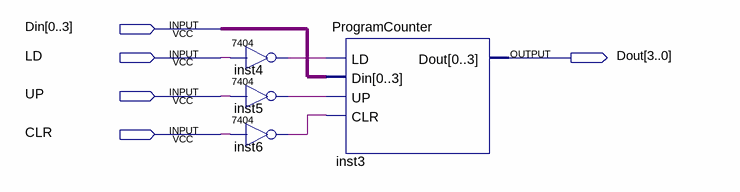
[diagram p0: schematic sheet]
// Quartus schematic PC.bdf as structural Verilog: 4 symbols, 5 pins
module PC (
  input  [0:3] Din,
  input  LD,
  input  UP,
  input  CLR,
  output [3:0] Dout
);

  wire inst4_1, inst5_1, inst6_1;

  \7404  inst4 (.\2 (LD), .\1 (inst4_1));
  \7404  inst5 (.\2 (UP), .\1 (inst5_1));
  \7404  inst6 (.\2 (CLR), .\1 (inst6_1));
  ProgramCounter inst3 (.LD(inst4_1), .Din(Din), .UP(inst5_1), .CLR(inst6_1), .Dout(Dout));
endmodule
